# Altium schematic sheet СФ МЭИ ЛБ ПЭ2-18 11.03.04 03 Э3.SchDoc
size 420 x 297 mm; Scale: 1:1; Разраб.: Попов А.Е.; Пров.: Смолин В.А.; Номер листа: 1; Общее количество листов: 1; Наименование изделия 1: Стабилизатор напряжения; Наименование изделия 2: Схема электрическая; Наименование изделия 3: принципиальная; Нач. отд.: Нач. отд.; Литера: У; Масштаб: 1:1; Децимальный номер: СФ МЭИ ЛБ ПЭ2-18 11.03.04 08 Э3; Наименование. Строка 2: для телевизора; Наименование. Строка 3: Схема электирическая принципиальная; Наименование. Строка 1: Блок питания; Разработал: Попов А.Е.; Проверил: Смолин В.А.; Утвердил: Рассказа Д.С.; Лист. Номер: 1; Лист. Всего: 1
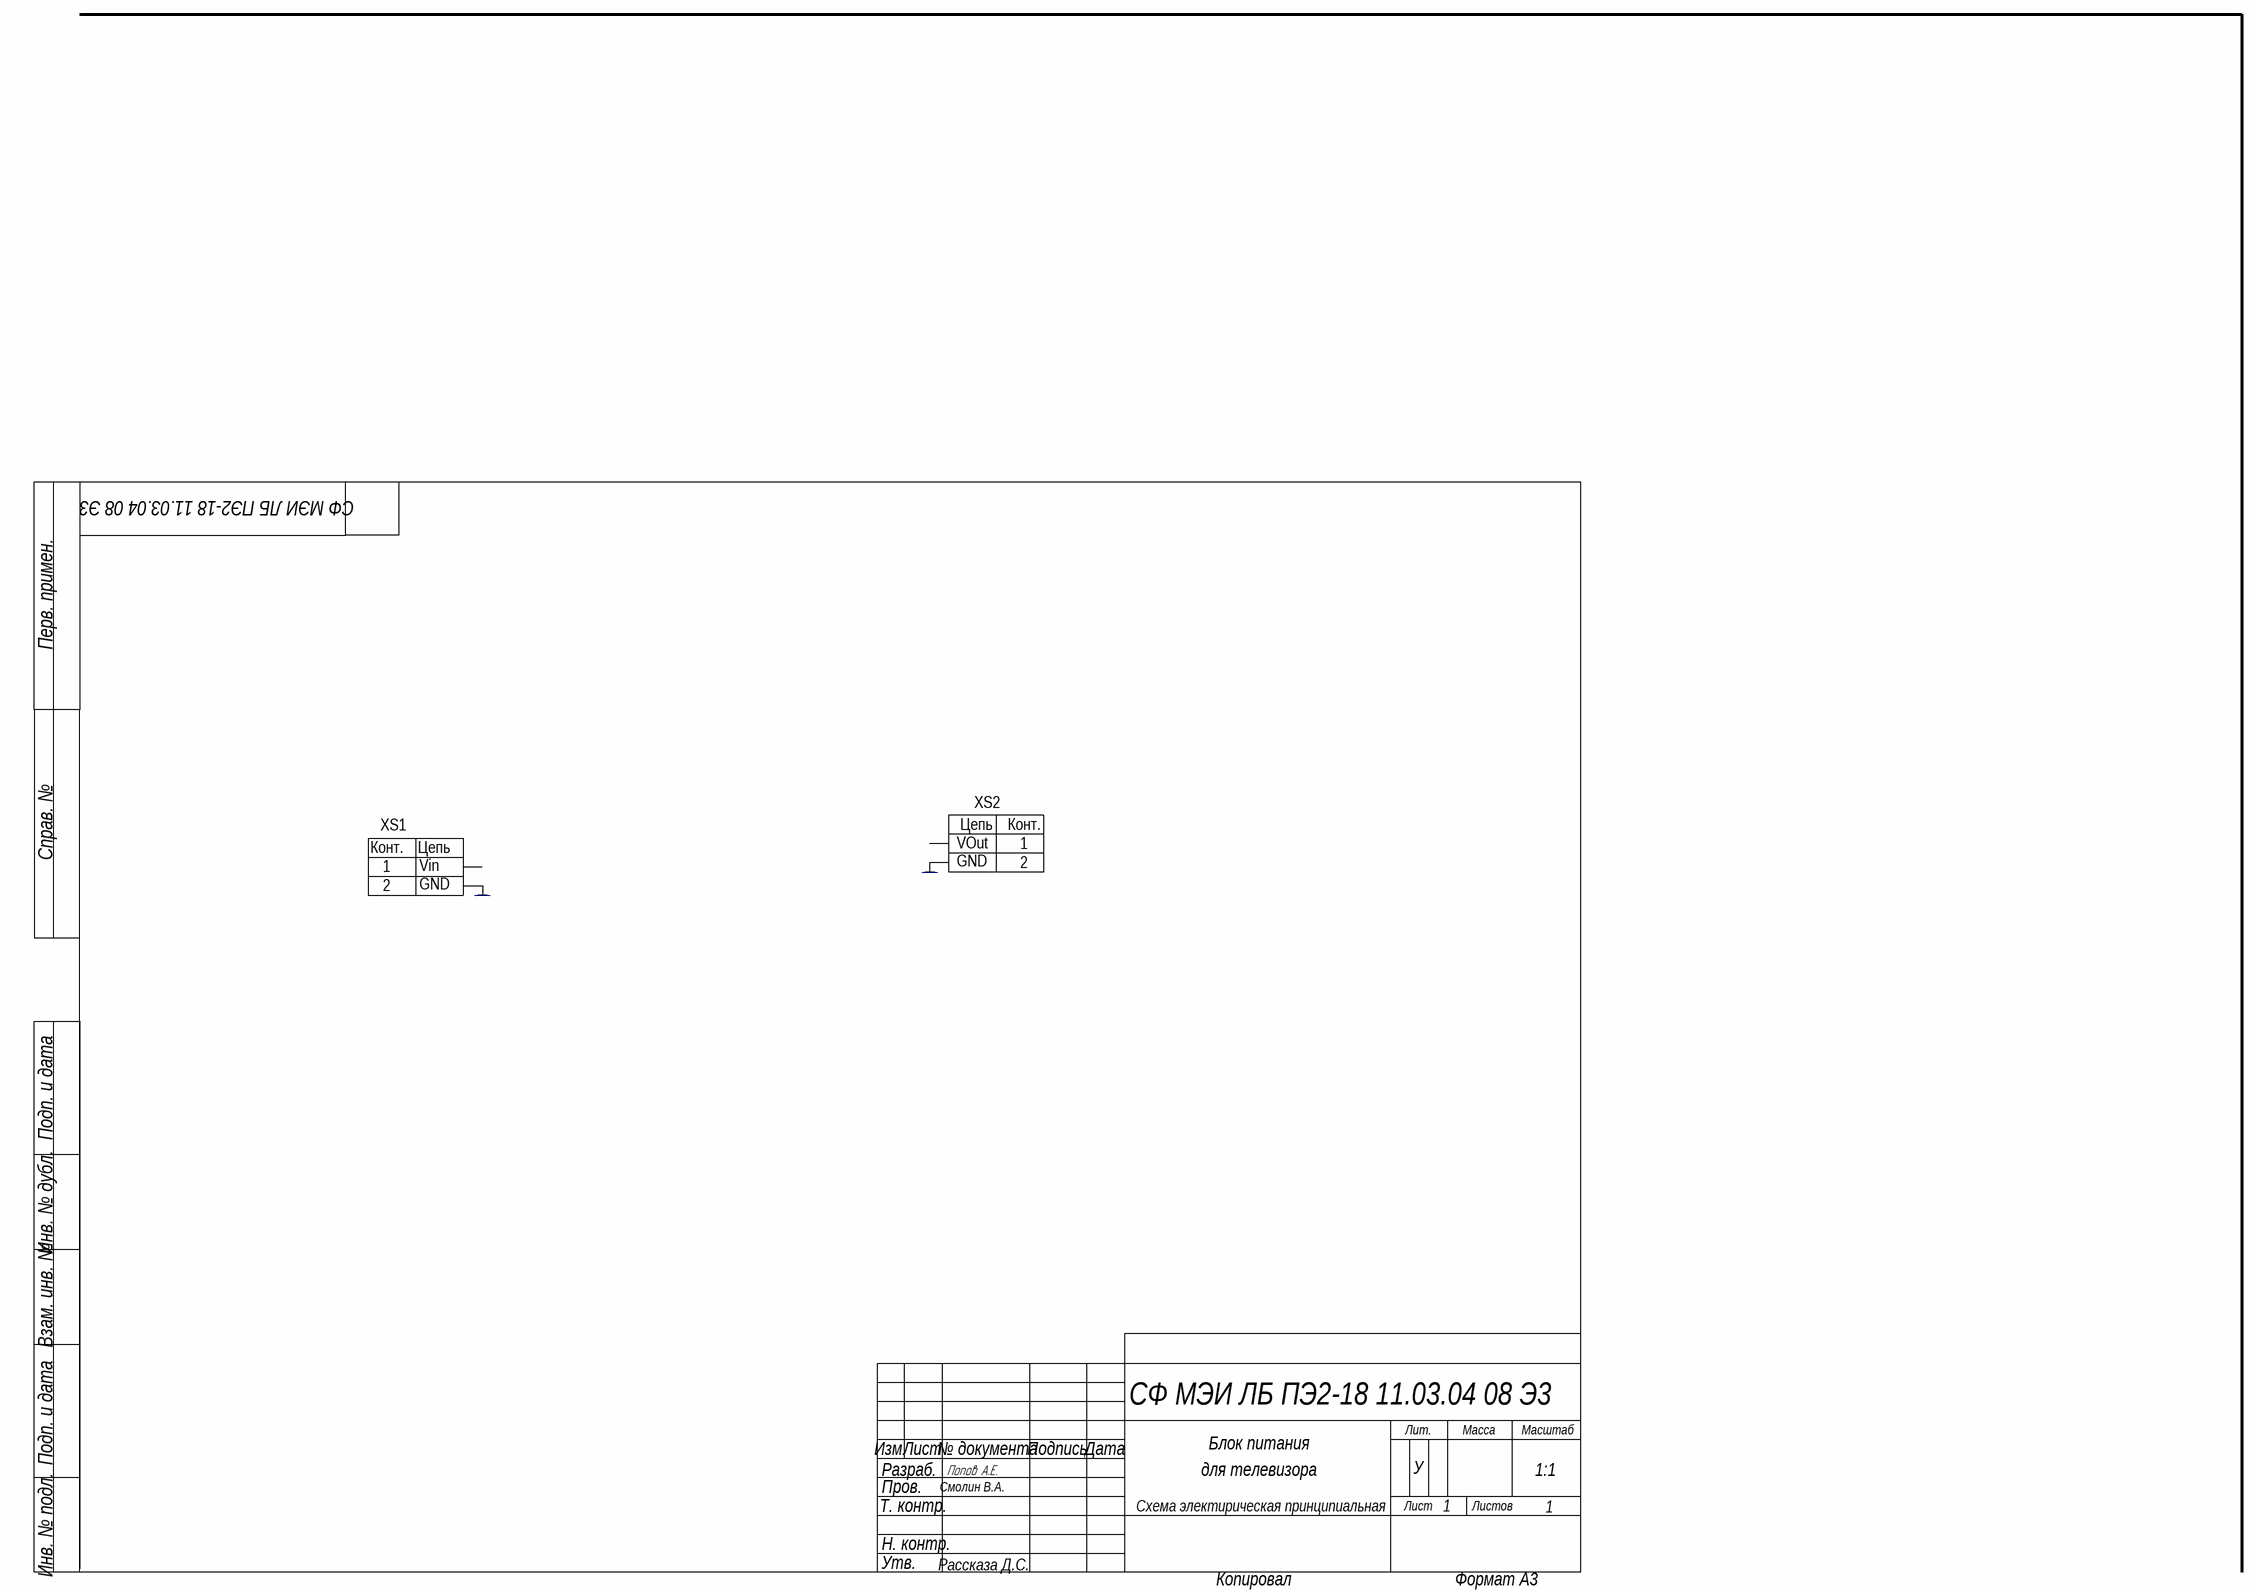
[diagram p0: СФ МЭИ ЛБ ПЭ2-18 11.03.04 03 Э3.SchDoc]

## Parts
XS1  DG126-5.0-0.2P  [DG126-5.0-02P]  (value not drawn)
XS2  DG126-5.0-0.2P  [DG126-5.0-02P]  (value not drawn)

## Nets
NetXS1_2: XS1.2(Pin2) XS2.2(Pin2)

Not connected (* = marked no-connect by the designer): XS1 1(Pin1); XS2 1(Pin1)

## Notes on the sheet
- (near XS1) Vin
- (near XS2) VOut
- (near XS2) GND
- (near XS1) GND
- Перв. примен.
- Справ. №
- Подп. и дата
- Инв. № дубл.
- Взам. инв. №
- Разраб.
- Изм.
- Лист
- № документа
- Подпись
- Дата
- Лит.
- Масса
- Масштаб
- Т. контр.
- Пров.
- Листов
- Инв. № подл.
- Н. контр.
- Утв.
- Копировал
- Формат A3
- (in symbol DG126-5.0-0.2P) Конт.; Цепь